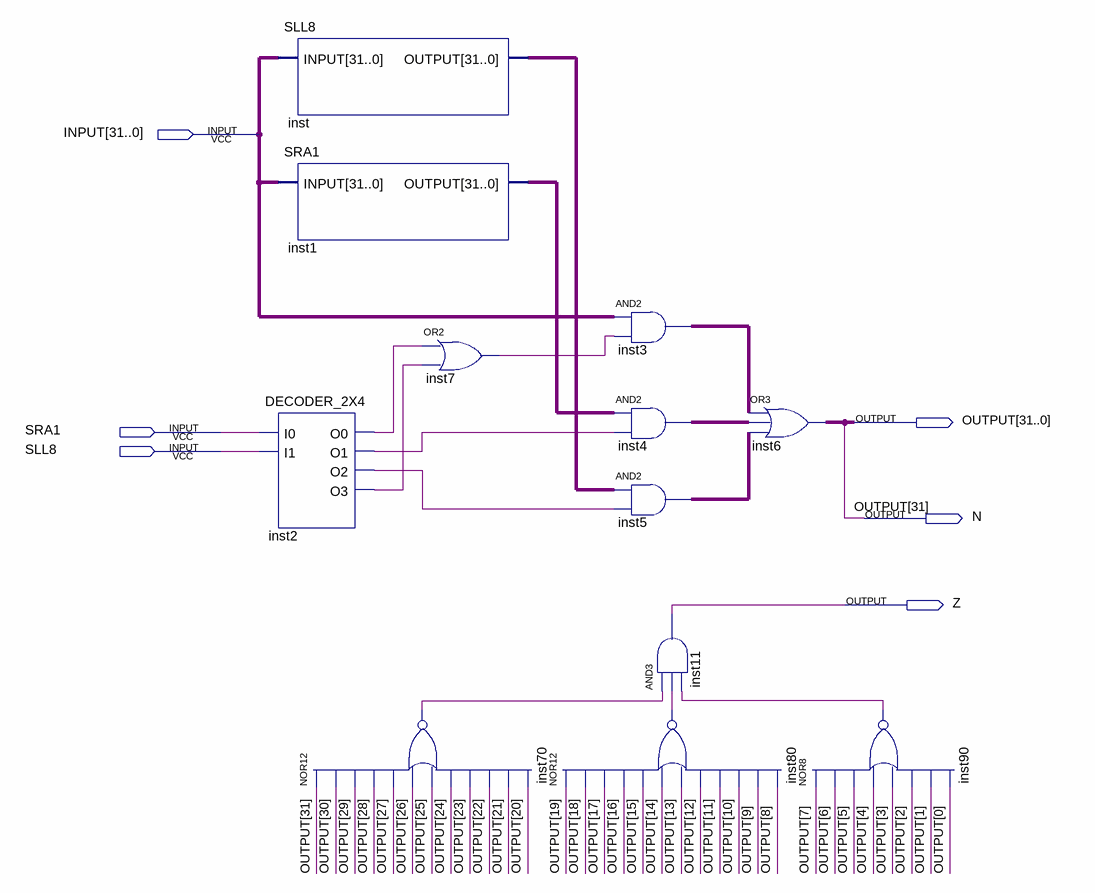
[diagram p0: schematic sheet]
// Quartus schematic SHIFTER.bdf as structural Verilog: 12 symbols, 6 pins
module SHIFTER (
  input  [31:0] INPUT,
  input  SRA1,
  input  SLL8,
  output [31:0] OUTPUT,
  output N,
  output Z
);

  wire inst2_o0, inst2_o1, inst2_o2, inst2_o3, inst7_out, inst70_out, inst80_out, inst90_out;
  wire [31:0] inst1_output, inst3_out, inst4_out, inst5_out, inst_output;

  SLL8 inst (.INPUT(INPUT), .OUTPUT(inst_output));
  SRA1 inst1 (.INPUT(INPUT), .OUTPUT(inst1_output));
  DECODER_2X4 inst2 (.I0(SRA1), .I1(SLL8), .O0(inst2_o0), .O1(inst2_o1), .O2(inst2_o2), .O3(inst2_o3));
  nor inst70 (inst70_out, N, OUTPUT[30], OUTPUT[29], OUTPUT[28], OUTPUT[27], OUTPUT[26], OUTPUT[25], OUTPUT[24], OUTPUT[23], OUTPUT[22], OUTPUT[21], OUTPUT[20]);
  or inst7 (inst7_out, inst2_o0, inst2_o3);
  nor inst80 (inst80_out, OUTPUT[19], OUTPUT[18], OUTPUT[17], OUTPUT[16], OUTPUT[15], OUTPUT[14], OUTPUT[13], OUTPUT[12], OUTPUT[11], OUTPUT[10], OUTPUT[9], OUTPUT[8]);
  assign inst3_out = INPUT & {32{inst7_out}};  // AND2 inst3, 32 bits wide
  assign inst4_out = inst1_output & {32{inst2_o1}};  // AND2 inst4, 32 bits wide
  assign inst5_out = inst_output & {32{inst2_o2}};  // AND2 inst5, 32 bits wide
  and inst11 (Z, inst70_out, inst80_out, inst90_out);
  assign {N, OUTPUT[30:0]} = inst3_out | inst4_out | inst5_out;  // OR3 inst6, 32 bits wide
  nor inst90 (inst90_out, OUTPUT[7], OUTPUT[6], OUTPUT[5], OUTPUT[4], OUTPUT[3], OUTPUT[2], OUTPUT[1], OUTPUT[0]);

  assign OUTPUT[31] = N;
endmodule
